# Altium schematic sheet PTFV_GECKO_PWR.SchDoc: PTFV_GECKO_PWR_&_RF
size A4; DrawnBy: Aneesh & Vaishnavi; Revision: 1; SheetNumber: 3; SheetTotal: 3  of  5
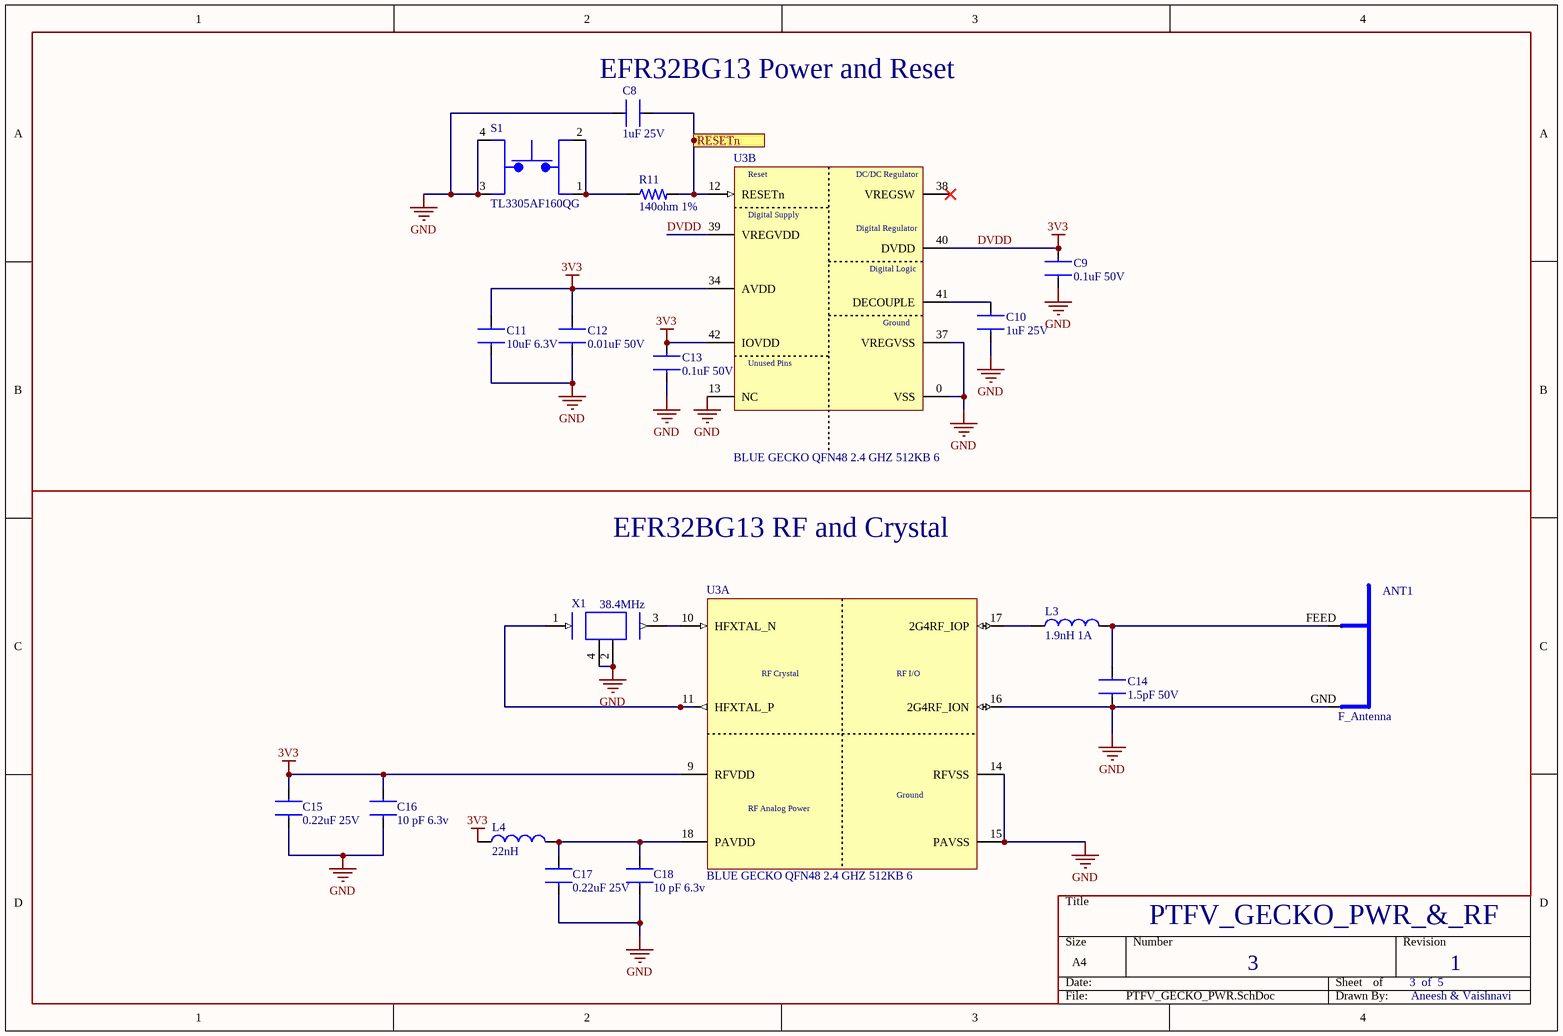
[diagram p0: PTFV_GECKO_PWR.SchDoc]

## Parts
ANT1  F_Antenna
C8  1uF 25V  [CAP_0603_1MM]
C9  0.1uF 50V  [CAP_0603_1MM]
C10  1uF 25V  [CAP_0603_1MM]
C11  10uF 6.3V  [CAP_0603_1MM]
C12  0.01uF 50V  [CAP_0603_1MM]
C13  0.1uF 50V  [CAP_0603_1MM]
C14  1.5pF 50V  [CAP_0402_1mm]
C15  0.22uF 25V  [CAP_0603_1MM]
C16  10 pF 6.3v  [CAP_0603_1MM]
C17  0.22uF 25V  [CAP_0603_1MM]
C18  10 pF 6.3v  [CAP_0603_1MM]
L3  1.9nH 1A  [CAP_0402_1mm]
L4  22nH  [IND_1608X10N]
R11  140ohm 1%  [RES_0603_1608X06]
S1  TL3305AF160QG  [SW_TL3305AF160QG]
U3  BLUE GECKO QFN48 2.4 GHZ 512KB 6  [QFN_48_7X7]  (parts A,B of 3)
X1  38.4MHz  [OSC_38.4MHz]

## Blocks framed on the sheet
EFR32BG13 Power and Reset: C8-C13 R11 S1 U3
EFR32BG13 RF and Crystal: ANT1 C14-C18 L3 L4 U3 X1

## Ports
RESETn (in, see PTFV_MECHANICAL[3A])

## Nets
DVDD: C9.1 C11.1 C12.1 C13.1 C15.1 C16.1 L4.1 U3.9(RFVDD) U3.34(AVDD) U3.39(VREGVDD) U3.40(DVDD) U3.42(IOVDD)  [also labelled 3V3]
GND: ANT1.GND C8.2 C9.2 C10.2 C11.2 C12.2 C13.2 C14.2 C15.2 C16.2 C17.2 C18.2 S1.3 S1.4 U3.0(VSS) U3.13(NC) U3.14(RFVSS) U3.15(PAVSS) U3.16(2G4RF_ION) U3.37(VREGVSS) X1.2 X1.4
RESETn: C8.1 R11.2 U3.12(RESETn) ; port RESETn
NetANT1_FEED: ANT1.FEED C14.1 L3.2
NetC10_1: C10.1 U3.41(DECOUPLE)
NetC17_1: C17.1 C18.1 L4.2 U3.18(PAVDD)
NetL3_1: L3.1 U3.17(2G4RF_IOP)
NetR11_1: R11.1 S1.1 S1.2
NetU3_10: U3.10(HFXTAL_N) X1.3
NetU3_11: U3.11(HFXTAL_P) X1.1

Not connected (* = marked no-connect by the designer): U3 38(VREGSW)*

## Notes on the sheet
- (in symbol EFR32BG13P632F512GM48-DR, part A) RF Crystal; RF I/O; Ground; RF Analog Power
- (in symbol EFR32BG13P632F512GM48-DR, part B) Reset; DC/DC Regulator; Digital Supply; Digital Regulator; Digital Logic; Ground; Unused Pins

## Library data of the parts
ANT1 = F_Antenna: Inverted F Antenna
C8 C10 = CC0603KRX5R8BB105: CAP CER 1uF 25V X5R 0603; Manufacturer: Yageo; Dielectric Material: Ceramic; Multilayer: Yes; Tolerance  (fill in as +-): 10%; Supplier: Digi-Key; Supplier Part Number: 311-1445-1-ND; Manufacturer Part Number: CC0603KRX5R8BB105; RoHS: Yes; Category: Ceramic Capacitors; Stock: 2764440; Pricing: 1=0.1, 10=0.074, 50=0.0418, 100=0.0346, 500=0.02428, 1000=0.0201 (USD); Mounting Technology: Surface Mount; Pins: 2; Package Shape: Rectangular; Case/Package: 0603; Terminal Finish: Nickel; Min Operating Temperature: -55°C; Max Operating Temperature: 85°C; JESD-609 Code: e3; Value: 1uF; Capacitor Type: Ceramic; Package Style: SMTMeter; Packaging: Tape and Reel; Tolerance (fill in as +-): 10%; Rated DC Voltage (URdc): 25V; Temperature Characteristics Code: X5R; Termination: Wraparound; Length: 1.6mm; Width: 0.8mm; Height: 0.8mm; Reach SVHC Compliant: Yes; RoHS Compliant: Yes; ComponentLink1URL: https://datasheet.ciiva.com:443/pdfs/VipMasterIC/IC/YAGO/YAGO-S-A0006851646/YAGO-S-A0006851646-1.pdf?src-supplier=IHS+Markit; ComponentLink1Description: https://datasheet.ciiva.com:443/pdfs/VipMasterIC/IC/YAGO/YAGO-S-A0006851646/YAGO-S-A0006851646-1.pdf?src-supplier=IHS+Markit; ComponentLink2URL: https://datasheet.ciiva.com/7978/1525783-7978171.pdf?src-supplier=Element14; ComponentLink2Description: https://datasheet.ciiva.com/7978/1525783-7978171.pdf?src-supplier=Element14; ComponentLink3URL: https://datasheet.ciiva.com/11586/upy-gphc-x5r-4v-to-50v-12-11586318.pdf?src-supplier=Avnet; ComponentLink3Description: https://datasheet.ciiva.com/11586/upy-gphc-x5r-4v-to-50v-12-11586318.pdf?src-supplier=Avnet; ComponentLink4URL: https://datasheet.ciiva.com/176/mlccorderingcode-176786.pdf?src-supplier=Digi-Key; ComponentLink4Description: https://datasheet.ciiva.com/176/mlccorderingcode-176786.pdf?src-supplier=Digi-Key; ComponentLink5URL: https://datasheet.ciiva.com/176/mlccorderingcode-176785.pdf?src-supplier=Digi-Key; ComponentLink5Description: https://datasheet.ciiva.com/176/mlccorderingcode-176785.pdf?src-supplier=Digi-Key; ComponentLink6URL: https://datasheet.ciiva.com/176/mlccorderingcode-176787.pdf?src-supplier=Digi-Key; ComponentLink6Description: https://datasheet.ciiva.com/176/mlccorderingcode-176787.pdf?src-supplier=Digi-Key
C9 C13 = CC0603KRX5R9BB104: CAP CER 0.1UF 50V X5R 0603; Manufacturer: Yageo; Value: 100nF; Tolerance: 10%; Supplier: Digi-Key; Supplier Part Number: 311-4046-1-ND; Manufacturer Part Number: CC0603KRX5R9BB104; RoHS: Yes; Category: Ceramic Capacitors; Stock: 45165; Pricing: 1=0.1, 10=0.052, 50=0.0282, 100=0.0231, 500=0.01648, 1000=0.01294 (USD); Mounting Technology: Surface Mount; Case/Package: 0603; Case Code (Imperial): 0603; Case Code (Metric): 1608; Weight: 7.1E-05oz; Min Operating Temperature: -55°C; Max Operating Temperature: 85°C; Packaging: Tape and Reel; Voltage Rating: 50V; Dielectric: X5R; Termination: SMD/SMT; Voltage Rating (DC): 50V; Package Quantity: 4000; Series: CC; Length: 0.063inch; Width: 0.031inch; Thickness: 0.035inch; Lead Free: Lead Free; Halogen Free: Halogen Free; ComponentLink1URL: http://www.mouser.com/ds/2/447/Yageo_UPY-GP_NP0_16V-to-50V_9-358835.pdf?src-supplier=Mouser; ComponentLink1Description: http://www.mouser.com/ds/2/447/Yageo_UPY-GP_NP0_16V-to-50V_9-358835.pdf?src-supplier=Mouser; ComponentLink2URL: http://www.yageo.com/exep/pages/download/literatures/ProductSelectionGuide%202014_Final_2.pdf?src-supplier=Digi-Key; ComponentLink2Description: http://www.yageo.com/exep/pages/download/literatures/ProductSelectionGuide%202014_Final_2.pdf?src-supplier=Digi-Key; ComponentLink3URL: https://datasheet.octopart.com/CC0603KRX5R9BB104-Yageo-datasheet-158238148.pdf?src-supplier=Newark; ComponentLink3Description: https://datasheet.octopart.com/CC0603KRX5R9BB104-Yageo-datasheet-158238148.pdf?src-supplier=Newark; ComponentLink4URL: https://www.yageo.com/upload/media/product/productsearch/datasheet/mlcc/UPY-GPHC_X5R_4V-to-50V_26.pdf?src-supplier=Digi-Key; ComponentLink4Description: https://www.yageo.com/upload/media/product/productsearch/datasheet/mlcc/UPY-GPHC_X5R_4V-to-50V_26.pdf?src-supplier=Digi-Key; ComponentLink5URL: https://datasheet.octopart.com/CC0603KRX5R9BB104-Yageo-datasheet-137875056.pdf?src-supplier=Future+Electronics; ComponentLink5Description: https://datasheet.octopart.com/CC0603KRX5R9BB104-Yageo-datasheet-137875056.pdf?src-supplier=Future+Electronics
C11 = CL10A106MQ8NNNC: CAP CER 10UF 6.3V X5R 0603; Manufacturer: Samsung; Tolerance: 20%; Supplier: Digi-Key; Supplier Part Number: 1276-1119-1-ND; Manufacturer Part Number: CL10A106MQ8NNNC; RoHS: Yes; Category: Ceramic Capacitors; Stock: 2041935; Pricing: 1=0.11, 10=0.083, 50=0.0452, 100=0.0369, 500=0.02638, 1000=0.02072 (USD); Mounting Technology: Surface Mount; Case/Package: 0603; Case Code (Metric): 1608; Case Code (Imperial): 0603; Min Operating Temperature: -55°C; Max Operating Temperature: 85°C; Packaging: Tape and Reel; Value: 10uF; Voltage Rating: 6.3V; Dielectric: X5R; Voltage: 6.3V; Series: CL; Construction: Flat; Length: 1.6mm; Height: 0.8mm; Depth: 0.8mm; Radiation Hardening: No; RoHS Compliant: Yes; ComponentLink1URL: https://datasheet.ciiva.com/25798/cl10a106mq8nnnc-25798320.pdf?src-supplier=Digi-Key; ComponentLink1Description: https://datasheet.ciiva.com/25798/cl10a106mq8nnnc-25798320.pdf?src-supplier=Digi-Key; ComponentLink2URL: https://datasheet.ciiva.com/26838/getdatasheetpartid-357557-26838347.pdf?src-supplier=Verical; ComponentLink2Description: https://datasheet.ciiva.com/26838/getdatasheetpartid-357557-26838347.pdf?src-supplier=Verical; ComponentLink3URL: https://datasheet.ciiva.com/16437/cl05b104kq5nnnc-16437327.pdf?src-supplier=Future+Electronics; ComponentLink3Description: https://datasheet.ciiva.com/16437/cl05b104kq5nnnc-16437327.pdf?src-supplier=Future+Electronics
C12 = CC0603KRX7R9BB103: CAP CER 0.01uF 50V X7R 0603; Manufacturer: Yageo; Dielectric Material: Ceramic; Value: 10nF; Multilayer: Yes; Tolerance  (fill in as +-): 10%; Supplier: Digi-Key; Supplier Part Number: 311-1085-1-ND; Manufacturer Part Number: CC0603KRX7R9BB103; RoHS: Yes; Category: Ceramic Capacitors; Stock: 5912727; Pricing: 1=0.1, 10=0.032, 50=0.0176, 100=0.0144, 500=0.01026, 1000=0.00805 (USD); Mounting Technology: Surface Mount; Pins: 2; Package Shape: Rectangular; Case/Package: 0603; Terminal Finish: Nickel; Min Operating Temperature: -55°C; Max Operating Temperature: 125°C; JESD-609 Code: e3; Capacitor Type: Ceramic; Package Style: SMTMeter; Packaging: Tape and Reel; Tolerance (fill in as +-): 10%; Rated DC Voltage (URdc): 50V; Temperature Characteristics Code: X7R; Termination: Wraparound; Length: 1.6mm; Width: 0.8mm; Height: 0.8mm; Reach SVHC Compliant: Yes; RoHS Compliant: Yes; ComponentLink1URL: https://datasheet.ciiva.com:443/pdfs/VipMasterIC/IC/YAGO/YAGO-S-A0003557223/YAGO-S-A0003557223-1.pdf?src-supplier=IHS+Markit; ComponentLink1Description: https://datasheet.ciiva.com:443/pdfs/VipMasterIC/IC/YAGO/YAGO-S-A0003557223/YAGO-S-A0003557223-1.pdf?src-supplier=IHS+Markit; ComponentLink2URL: https://datasheet.ciiva.com/28450/1489800-28450619.pdf?src-supplier=Element14; ComponentLink2Description: https://datasheet.ciiva.com/28450/1489800-28450619.pdf?src-supplier=Element14; ComponentLink3URL: https://datasheet.ciiva.com/176/mlccorderingcode-176551.pdf?src-supplier=Digi-Key; ComponentLink3Description: https://datasheet.ciiva.com/176/mlccorderingcode-176551.pdf?src-supplier=Digi-Key; ComponentLink4URL: https://datasheet.ciiva.com/176/mlccorderingcode-176550.pdf?src-supplier=Digi-Key; ComponentLink4Description: https://datasheet.ciiva.com/176/mlccorderingcode-176550.pdf?src-supplier=Digi-Key; ComponentLink5URL: https://datasheet.ciiva.com/13389/upy-gphc-x7r-6-3v-to-50v-8-13389991.pdf?src-supplier=Mouser; ComponentLink5Description: https://datasheet.ciiva.com/13389/upy-gphc-x7r-6-3v-to-50v-8-13389991.pdf?src-supplier=Mouser
C14 = GCM1555C1H1R5JA16D: CAP CER 1.5pF 50V C0G 5% Pad SMD 0402 125C Automotive T/R; Manufacturer: Murata; Supplier 1: Digi-Key; Manufacturer Part Number: GCM1555C1H1R5JA16D; RoHS: Yes; Category: Ceramic Capacitors; Stock 1: 77943; Pricing 1: 1=0.10000, 10=0.04700, 50=0.02580, 100=0.02100, 500=0.01502, 1000=0.01180, 2500=0.01072, 5000=0.00987 (USD); Mount: Surface Mount; Case/Package: 0402; Case Code (Imperial): 0402; Case Code (Metric): 1005; Min Operating Temperature: -55°C; Max Operating Temperature: 125°C; Packaging: Cut Tape; Capacitance: 1.5pF; Tolerance: 5%; Voltage Rating: 50V; Ratings: AEC-Q200; ComponentLink1URL: http://search.murata.co.jp/Ceramy/image/img/A01X/G101/ENG/GCM1555C1H1R5JA16-01.pdf?src-supplier=Digi-Key; ComponentLink1Description: http://search.murata.co.jp/Ceramy/image/img/A01X/G101/ENG/GCM1555C1H1R5JA16-01.pdf?src-supplier=Digi-Key
C15 C17 = VJ0603Y224KXXCW1BC: CAP CER 0.22UF 25V X7R 0603; Manufacturer: Vishay Vitramon; Dielectric Material: Tantalum; Value: 220nF; Tolerance: 10%; Supplier: Digi-Key; Supplier Part Number: 720-VJ0603Y224KXXCW1BCCT-ND; Manufacturer Part Number: VJ0603Y224KXXCW1BC; RoHS: Yes; Category: Ceramic Capacitors; Stock: 7772; Pricing: 1=0.17, 10=0.116, 50=0.0696, 100=0.0587, 500=0.04018, 1000=0.03554 (USD); Mounting Technology: Surface Mount; Case/Package: 0603; Min Operating Temperature: -55°C; Max Operating Temperature: 125°C; Dielectric: X7R; Voltage Rating (DC): 25V; Construction: Flat; Length: 1.6mm; Depth: 0.8mm; Lead Free: Lead Free; RoHS Compliant: Yes; ComponentLink1URL: https://www.vishay.com/docs/28548/vjw1bcbascomseries.pdf?src-supplier=Digi-Key; ComponentLink1Description: https://www.vishay.com/docs/28548/vjw1bcbascomseries.pdf?src-supplier=Digi-Key; ComponentLink2URL: http://www.vishay.com/docs/28548/vjw1bcbascomseries.pdf?src-supplier=Avnet; ComponentLink2Description: http://www.vishay.com/docs/28548/vjw1bcbascomseries.pdf?src-supplier=Avnet; ComponentLink3URL: https://datasheet.octopart.com/VJ0603Y224KXXCW1BC-Vishay-datasheet-79783898.pdf?src-supplier=Future+Electronics; ComponentLink3Description: https://datasheet.octopart.com/VJ0603Y224KXXCW1BC-Vishay-datasheet-79783898.pdf?src-supplier=Future+Electronics
C16 C18 = 06036A100FAT2A: CAP CER 10pF 6.3V 0603; Manufacturer: Kyocera AVX; Tolerance: 1%; Dielectric: C0G; Supplier: Digi-Key; Supplier Part Number: 478-06036A100FAT2ACT-ND; Manufacturer Part Number: 06036A100FAT2A; RoHS: Yes; Category: Ceramic Capacitors; Stock: 26845; Pricing: 1=0.16, 10=0.112, 50=0.0636, 100=0.0526, 500=0.0369, 1000=0.03054 (USD); Mounting Technology: Surface Mount; Case/Package: 0603; Min Operating Temperature: -55°C; Max Operating Temperature: 125°C; Value: 10pF; Package Quantity: 4000; Packaging: Tape and Reel; Voltage Rating (DC): 6.3V; Construction: Flat; Length: 1.6mm; Depth: 0.81mm; RoHS Compliant: Yes; ComponentLink1URL: http://www.mouser.com/ds/2/40/C0GNP0-Dielectric-951274.pdf?src-supplier=Mouser; ComponentLink1Description: http://www.mouser.com/ds/2/40/C0GNP0-Dielectric-951274.pdf?src-supplier=Mouser
L3 = LQG15WZ1N9S02D: Inductor Chip 1.9nH 0.3nH Tolerance 2-Pin 0402 Paper T/R; Manufacturer: Murata; Supplier 1: Digi-Key; Manufacturer Part Number: LQG15WZ1N9S02D; RoHS: Yes; Category: Fixed Inductors; Stock 1: 7252; Pricing 1: 1=0.14000, 10=0.12900, 25=0.11440, 50=0.09720, 100=0.08580, 250=0.07864, 500=0.07150, 1000=0.06006, 2500=0.05148 (USD); RoHS Compliant: Yes
L4 = 7447860122: IND CER  22nH, 1.6Ghz, 0.3A, 0603 Rohs Compliant: Yes; Manufacturer: Wurth Electronics; Supplier: Digi-Key; Supplier Part Number: 732-7447860122CT-ND; Manufacturer Part Number: 7447860122; RoHS: No; Stock: 16578; Pricing: 1=0.1, 10=0.058, 50=0.054, 100=0.05, 1000=0.046 (USD); RoHS Compliant: Yes
R11 = RC0603FR-07140RL: RES SMD 140 OHM 1% 1/10W 0603; Manufacturer: Yageo; Additional Feature: LASER TRIMMABLE; Power: 100mW; Rated Temperature: 70°C; Value: 140R; Temperature Coefficient: 100ppm/°C; Working Voltage: 75V; Package Height: 0.45mm; Package Length: 1.6mm; Package Width: 0.8mm; Supplier: Digi-Key; Supplier Part Number: 311-140HRCT-ND; Manufacturer Part Number: RC0603FR-07140RL; RoHS: Yes; Category: Chip SMD Resistors; Stock: 420006; Pricing: 1=0.1, 10=0.018, 50=0.0106, 100=0.0088, 500=0.00592, 1000=0.00505 (USD); Mounting Technology: Surface Mount; Pins: 2; Package Shape: Rectangular; Case/Package: 0603; Terminal Finish: Nickel; Min Operating Temperature: -55°C; Max Operating Temperature: 155°C; Tolerance: 1%; JESD-609 Code: e3; Resistor Type: FIXED RESISTOR; Construction: Chip; Package Style: SMTMeter; Packaging: Tape and Reel; Technology: METAL GLAZE/THICK FILM; Termination: Wraparound; Reach SVHC Compliant: Yes; RoHS Compliant: Yes; ComponentLink1URL: https://datasheet.ciiva.com:443/pdfs/VipMasterIC/IC/YAGO/YAGO-S-A0008145938/YAGO-S-A0008145938-1.pdf?src-supplier=IHS+Markit; ComponentLink1Description: https://datasheet.ciiva.com:443/pdfs/VipMasterIC/IC/YAGO/YAGO-S-A0008145938/YAGO-S-A0008145938-1.pdf?src-supplier=IHS+Markit; ComponentLink2URL: https://datasheet.ciiva.com/11808/0900766b80c66297-11808828.pdf?src-supplier=Rs; ComponentLink2Description: https://datasheet.ciiva.com/11808/0900766b80c66297-11808828.pdf?src-supplier=Rs; ComponentLink3URL: https://datasheet.ciiva.com/15189/getdatasheetpartid-329205-15189606.pdf?src-supplier=Verical; ComponentLink3Description: https://datasheet.ciiva.com/15189/getdatasheetpartid-329205-15189606.pdf?src-supplier=Verical
S1 = TL3305AF160QG: Tactile Switch SPST-NO Top Actuated Surface Mount; MF: E-Switch; Package: None; Check_prices: https://www.snapeda.com/parts/TL3305AF160QG/E-Switch/view-part/?ref=eda; Value: *; Purchase-URL: https://pricing.snapeda.com/search/part/TL3305AF160QG/?ref=eda; Availability: In Stock; SnapEDA_Link: https://www.snapeda.com/parts/TL3305AF160QG/E-Switch/view-part/?ref=snap; MP: TL3305AF160QG; Price: None
U3 = EFR32BG13P632F512GM48-DR: Blue Gecko BLE Soc QFN48 2.4 G 10 dB BLE/Proprietary 512 kB 64 kB(RAM) 31GPIO; Manufacturer: Silicon Labs; Interface: I2C,SPI,IrDA,UART,USART; Frequency: 2.4835GHz; Data Rate: 2Mbps; Sensitivity: -103.3dBm; Memory Size: 64KB; Current - Receiving: 14mA; Current - Transmitting: 134.3mA; Number of GPIO: 16; Supplier: Digi-Key; Supplier Part Number: 336-EFR32BG13P632F512GM48-DRCT-ND; Manufacturer Part Number: EFR32BG13P632F512GM48-DR; RoHS: Yes; Category: RF Receivers, Transceivers; Stock: 17415; Pricing: 1=7.18, 10=6.577, 25=5.9792, 100=5.3813, 250=4.93284, 500=4.4844, 1000=4.03596 (USD); Mounting Technology: Surface Mount; Case/Package: QFN; Min Operating Temperature: -40°C; Max Operating Temperature: 85°C; Series: EFR32™ Blue Gecko; RoHS Compliant: Yes
X1 = RH100-38.400-10-F-1010-TR: Crystal 38.4000MHZ 10PF SMD; Manufacturer: Raltron Electronics; Supplier 1: Digi-Key; Manufacturer Part Number: RH100-38.400-10-F-1010-TR; RoHS: Yes; Stock 1: 6000; Pricing 1: 1=0.39000, 10=0.32400, 50=0.29180, 100=0.25940, 500=0.24640, 1000=0.20750 (USD)